# EAGLE design Assignment (EAGLE 7.3.0)
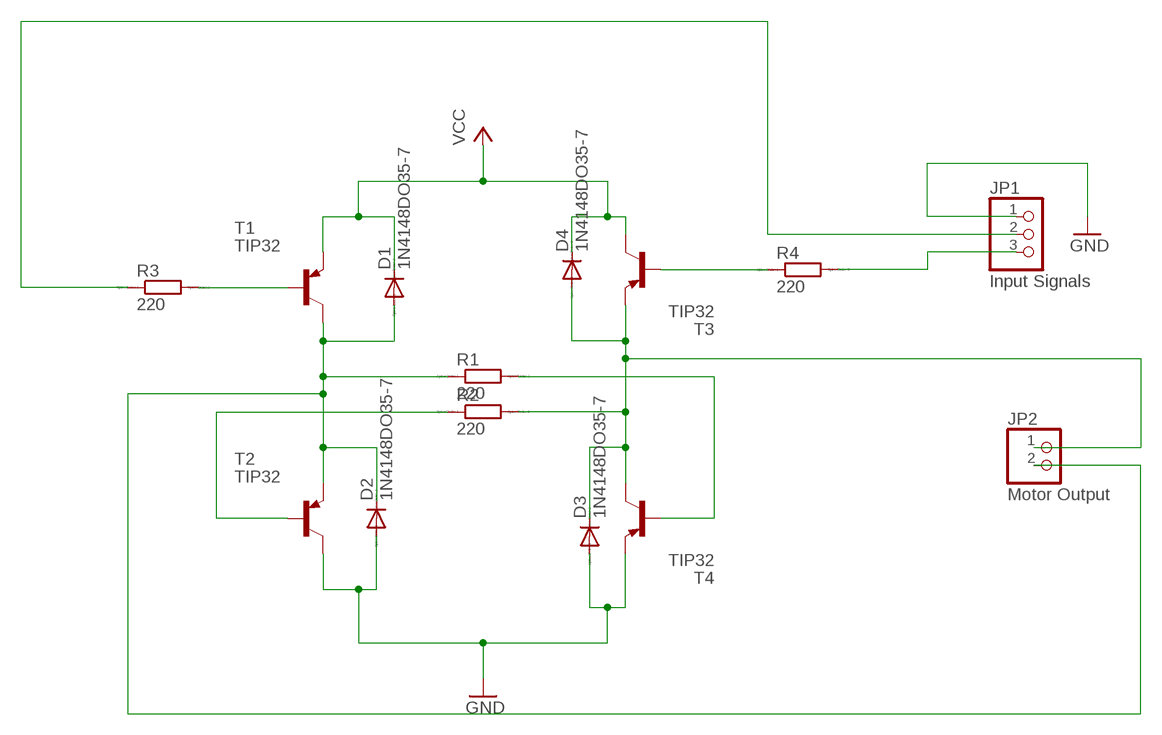
[diagram p0: schematic, sheet 1]

## Parts
D1  1N4148DO35-7  [DO35-7]
D2  1N4148DO35-7  [DO35-7]
D3  1N4148DO35-7  [DO35-7]
D4  1N4148DO35-7  [DO35-7]
JP1  Input Signals  PINHD-1X3  [1X03]
JP2  Motor Output  PINHD-1X2  [1X02]
R1  220  R0204/7  [0204/7]
R2  220  R0204/7  [0204/7]
R3  220  R0204/7  [0204/7]
R4  220  R0204/7  [0204/7]
T1  TIP32  [TO220]
T2  TIP32  [TO220]
T3  TIP32  [TO220]
T4  TIP32  [TO220]

## Nets
GND: D2.A D3.A JP1.1 T2.2(C) T4.3(E)
N$1: JP1.3 R4.2
N$2: D1.A D2.C JP2.2 R1.1 T1.2(C) T2.3(E)
N$3: D3.C D4.A JP2.1 R2.2 T3.3(E) T4.2(C)
N$4: JP1.2 R3.1
N$7: R4.1 T3.1(B)
N$8: R2.1 T2.1(B)
N$9: R1.2 T4.1(B)
N$10: R3.2 T1.1(B)
VCC: D1.C D4.C T1.3(E) T3.2(C)

## Library data of the parts
D1-D4 = diode:1N4148: DIODE high speed (Philips)
JP1 = adafruit:PINHD-1X3: PIN HEADER
JP2 = pinhead:PINHD-1X2: PIN HEADER
R1-R4 = eagle-ltspice:R: RESISTOR, European symbol; SPICEMODEL: NONE; SPICEPREFIX: R
T1-T4 = transistor:TIP32: PNP Transistor Medium Power Linear Switching Applications Source: http://onsemi.com

## Board
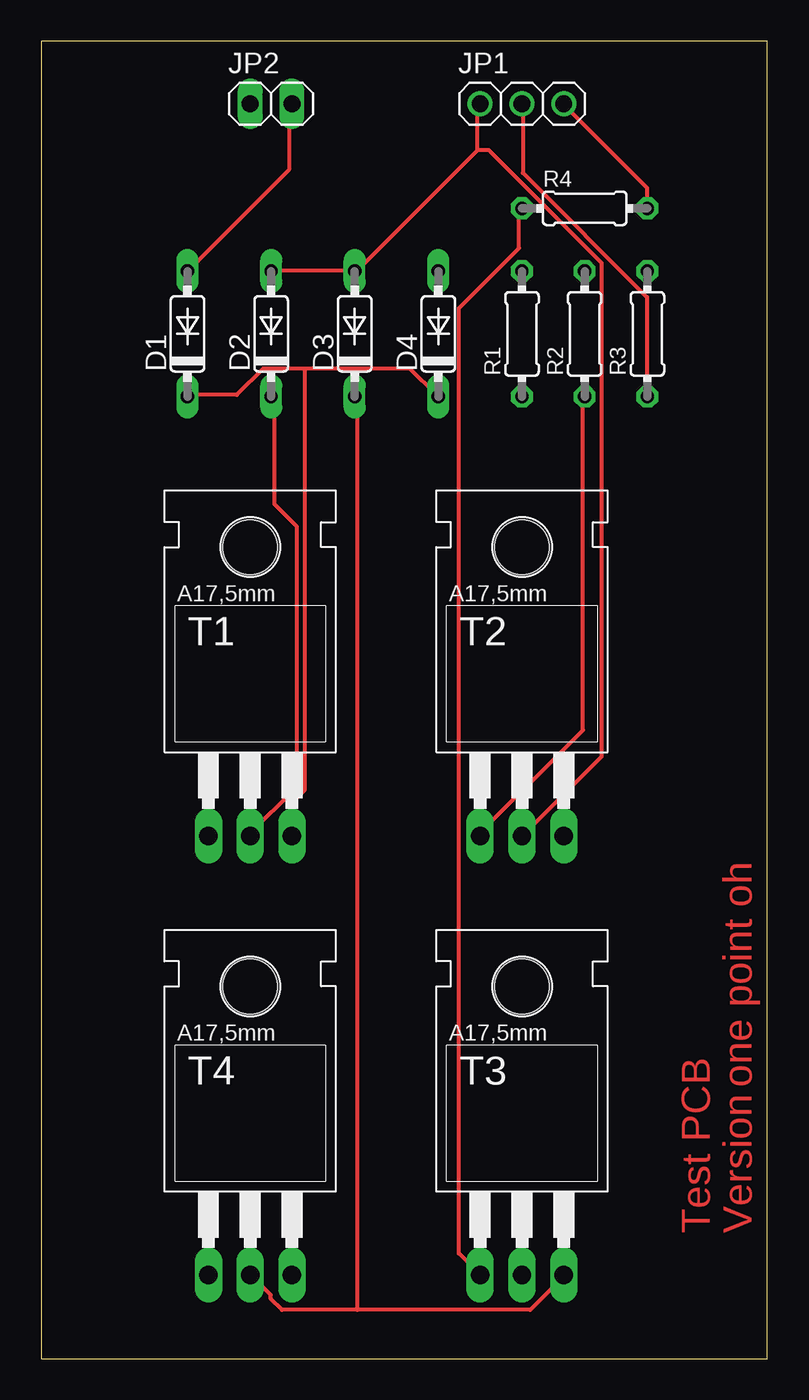
[diagram p1: board, top side]
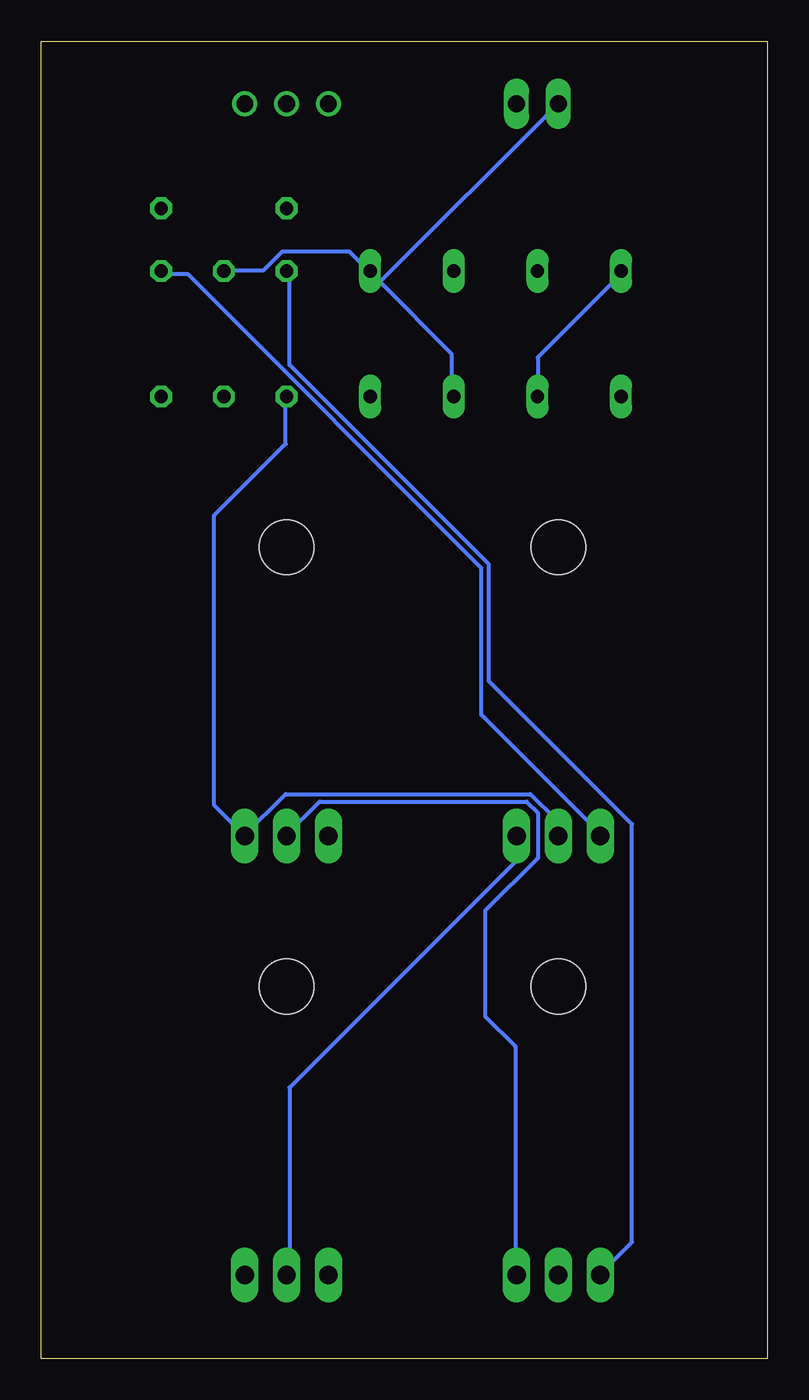
[diagram p2: board, bottom side, seen from below]

Size 44.12 x 80 mm. Coordinates in mm from the lower left corner, seen from the top.
Outline: 0,0 44.12,0 44.12,80 0,80 0,0
Copper layers (1*16): Top 0.035mm / dielectric 1.5mm / Bottom 0.035mm
Design rules "default": minimum track width 10mil, minimum drill 24mil, track to track 8mil, track to pad 8mil, pad to pad 8mil, via to via 8mil, smd to smd 8mil, copper to edge 40mil, drill to drill 8mil, minimum pad ring 10mil, minimum via ring 8mil, stop-mask expansion 4mil, vias tented up to drill 0mil, thermal gap 10mil

### Footprints (pad centres in the part's own frame; a part is rotated, then mirrored left to right if it is on the bottom)
DO35-7 = drill 0.813 long: A 3.81,0; C -3.81,0
1X03 = drill 1.016: 1 -2.54,0; 2 0,0; 3 2.54,0
1X02 = drill 1.016 long: 1 -1.27,0; 2 1.27,0
0204/7 = drill 0.813 octagon: 1 -3.81,0; 2 3.81,0
TO220 = drill 1.118 long: 1 -2.54,-6.35; 2 0,-6.35; 3 2.54,-6.35 | hole 3.302: 0,11.176

### Placement (x,y rotation side)
D1  8.89,62.23 90 top
D2  13.97,62.23 90 top
D3  19.05,62.23 90 top
D4  24.13,62.23 90 top
JP1  29.21,76.2 0 top
JP2  13.97,76.2 0 top
R1  29.21,62.23 90 top
R2  33.02,62.23 90 top
R3  36.83,62.23 90 top
R4  33.02,69.85 0 top
T1  12.7,38.1 0 top
T2  29.21,38.1 0 top
T3  29.21,11.43 0 top
T4  12.7,11.43 0 top

### Tracks (layer width: path | path; a pad name or v marks a point on that pad's centre or on a via)
GND
  Top 0.254: D2.A 14.17,66.06 18.97,66.06 D3.A 19.2,66.06 26.52,73.38 | 26.52,73.38 26.52,76.12 JP1.1 | 26.52,73.38 27.2,73.38 34.06,66.52 34.06,36.58 29.26,31.77 T2.2
  Bottom 0.254: T4.3 15.32,5.26 15.32,18.97 17.14,20.8 17.14,27.2 13.95,30.4 13.95,33.15 14.63,33.83 27.2,33.83 29.26,31.77 T2.2
N$1
  Top 0.254: R4.2 36.8,69.95 36.8,71.09 31.77,76.12 JP1.3
N$2
  Top 0.254: D1.A 15.09,72.24 15.09,76.12 JP2.2 | D2.C 14.17,58.29 14.17,51.89 15.54,50.52 15.54,34.75 12.57,31.77 T1.2
  Bottom 0.254: D2.C 13.95,58.52 13.95,60.81 8.91,65.84 D1.A | 31.77,31.77 33.6,33.6 33.6,51.21 29.26,55.55 29.26,58.29 R1.1 | 31.77,31.77 29.26,34.29 14.4,34.29 12.8,32.69 12.8,31.77 T1.2 | 31.77,31.77 T2.3
N$3
  Top 0.254: 19.2,2.97 29.72,2.97 31.77,5.03 T3.3 | 19.2,2.97 14.63,2.97 13.95,3.66 13.95,3.89 12.8,5.03 T4.2 | 19.2,2.97 19.2,58.29 D3.C
  Bottom 0.254: 23.55,65.38 24,65.84 D4.A | 23.55,65.38 19.2,61.04 19.2,58.52 D3.C | R2.2 32.92,66.06 30.63,66.06 29.49,67.21 25.38,67.21 24.23,66.06 D4.A | 23.55,65.38 12.8,76.12 JP2.1 | 23.55,65.38 D4.A
N$4
  Top 0.254: R3.1 36.8,58.52 36.8,64.47 29.26,72.01 29.26,76.12 JP1.2
N$7
  Top 0.254: R4.1 29.03,69.72 29.03,67.44 25.38,63.78 25.38,6.4 26.52,5.26 T3.1
N$8
  Top 0.254: R2.1 32.92,58.29 32.92,38.18 26.52,31.77 T2.1
N$9
  Bottom 0.254: R1.2 29.03,65.84 29.03,60.35 16.92,48.23 16.92,41.15 8.23,32.46 8.23,7.09 10.06,5.26 T4.1
N$10
  Bottom 0.254: R3.2 36.8,65.84 35.2,65.84 17.37,48.01 17.37,39.09 10.06,31.77 T1.1
VCC
  Top 0.254: 16,60.12 22.4,60.12 24,58.52 D4.C | 16,60.12 13.49,60.12 11.89,58.52 8.91,58.52 D1.C | 16,60.12 16,34.52 15.32,33.83 15.32,31.77 T1.3
  Bottom 0.254: T3.2 29.03,5.26 29.03,16.46 15.32,30.18 15.32,31.55 T1.3

### Text on the board
Top: one point oh | Test PCB | Version